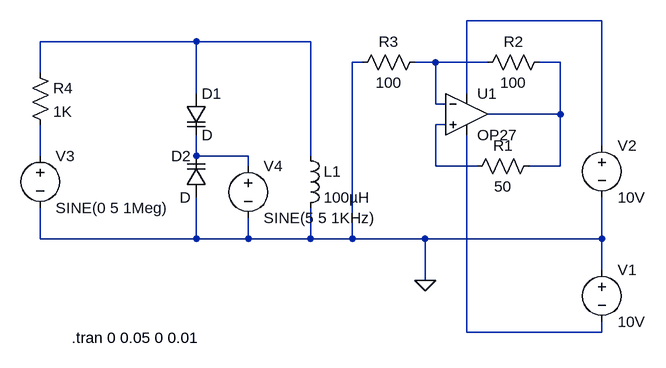
[diagram p0: schematic varicap.asc]
varicap.asc, the LTspice schematic file:
Version 4
SHEET 1 880 680
WIRE 656 -80 448 -80
WIRE 32 -48 -208 -48
WIRE 208 -48 32 -48
WIRE 288 -16 272 -16
WIRE 400 -16 368 -16
WIRE 480 -16 400 -16
WIRE 592 -16 560 -16
WIRE -208 0 -208 -48
WIRE 32 32 32 -48
WIRE 448 32 448 -80
WIRE 400 48 400 -16
WIRE 416 48 400 48
WIRE 592 64 592 -16
WIRE 592 64 480 64
WIRE 416 80 400 80
WIRE 656 112 656 -80
WIRE -208 128 -208 80
WIRE 32 128 32 96
WIRE 112 128 32 128
WIRE 208 128 208 -48
WIRE 112 144 112 128
WIRE 400 144 400 80
WIRE 464 144 400 144
WIRE 592 144 592 64
WIRE 592 144 544 144
WIRE -208 256 -208 208
WIRE 32 256 32 192
WIRE 32 256 -208 256
WIRE 112 256 112 224
WIRE 112 256 32 256
WIRE 208 256 208 208
WIRE 208 256 112 256
WIRE 272 256 272 -16
WIRE 272 256 208 256
WIRE 384 256 272 256
WIRE 656 256 656 192
WIRE 656 256 384 256
WIRE 656 304 656 256
WIRE 384 320 384 256
WIRE 448 400 448 96
WIRE 656 400 656 384
WIRE 656 400 448 400
FLAG 384 320 0
SYMBOL ind 192 112 R0
SYMATTR InstName L1
SYMATTR Value 100µH
SYMBOL Opamps\\OP27 448 0 R0
SYMATTR InstName U1
SYMBOL res 560 128 R90
WINDOW 0 0 56 VBottom 2
WINDOW 3 32 56 VTop 2
SYMATTR InstName R1
SYMATTR Value 50
SYMBOL res 576 -32 R90
WINDOW 0 0 56 VBottom 2
WINDOW 3 32 56 VTop 2
SYMATTR InstName R2
SYMATTR Value 100
SYMBOL res 384 -32 R90
WINDOW 0 0 56 VBottom 2
WINDOW 3 32 56 VTop 2
SYMATTR InstName R3
SYMATTR Value 100
SYMBOL voltage 656 288 R0
WINDOW 123 0 0 Left 2
WINDOW 39 0 0 Left 2
SYMATTR InstName V1
SYMATTR Value 10V
SYMBOL voltage 656 96 R0
WINDOW 123 0 0 Left 2
WINDOW 39 0 0 Left 2
SYMATTR InstName V2
SYMATTR Value 10V
SYMBOL varactor 16 32 R0
SYMATTR InstName D1
SYMBOL varactor 48 192 R180
WINDOW 0 24 64 Left 2
WINDOW 3 24 0 Left 2
SYMATTR InstName D2
SYMBOL voltage -208 112 R0
WINDOW 39 0 0 Left 2
SYMATTR Value2 AC 1 0
SYMATTR InstName V3
SYMATTR Value SINE(0 5 1Meg)
SYMBOL res -224 -16 R0
SYMATTR InstName R4
SYMATTR Value 1K
SYMBOL voltage 112 128 R0
WINDOW 123 0 0 Left 2
WINDOW 39 0 0 Left 2
SYMATTR InstName V4
SYMATTR Value SINE(5 5 1KHz)
TEXT -160 408 Left 2 !.tran 0 0.05 0 0.01

The netlist it stands for:
* varicap.asc
L1 N002 0 100µH
XU1 N005 N003 N001 N008 N004 OP27  ; pins In+ In- V+ V- OUT
R1 N004 N005 50
R2 N004 N003 100
R3 N003 0 100
V1 0 N008 10V
V2 N001 0 10V
D1 N002 N007 D
D2 0 N007 D
V3 N006 0 SINE(0 5 1Meg) AC 1 0
R4 N002 N006 1K
V4 N007 0 SINE(5 5 1KHz)
.model D D
.lib standard.dio
.tran 0 0.05 0 0.01
.lib ADI.lib
.backanno
.end